# Altium project 采样模块1.PrjPcb
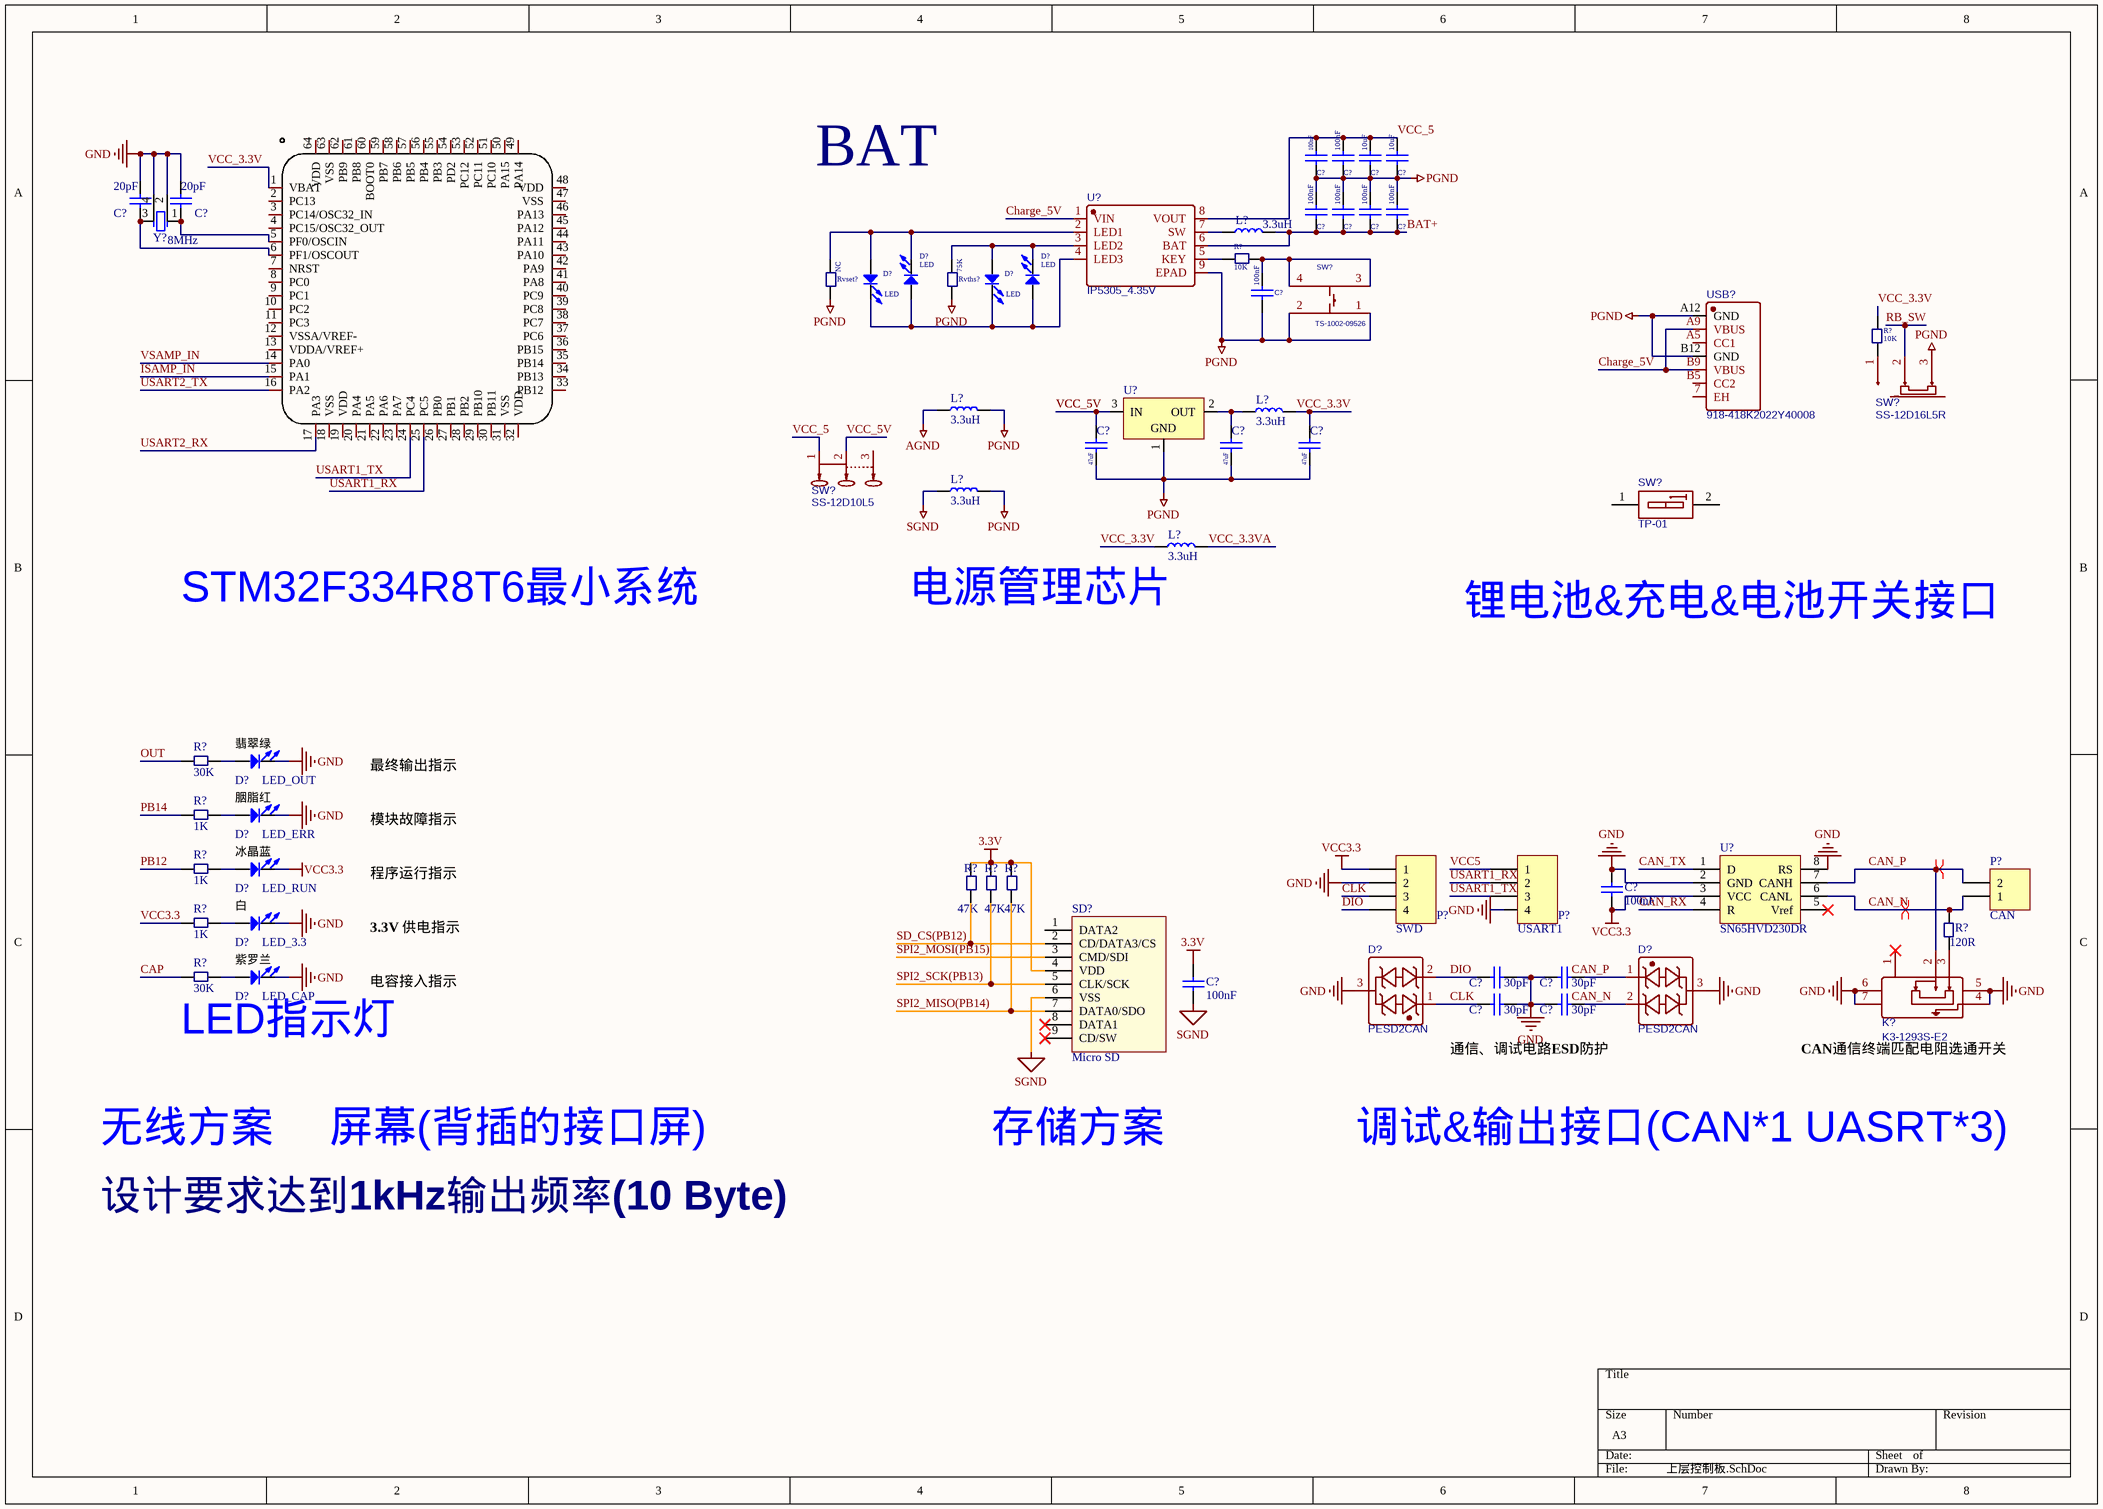
[diagram p0: 上层控制板.SchDoc]
3 sheets, 99 parts. Net scope: global (net labels, ports and power ports of the same name join across sheets).
Sheets:
  上层控制板.SchDoc
  下层功率板(铝基).SchDoc
  采样方案.SchDoc

## Sheet 上层控制板.SchDoc
size A3; SheetNumber: 1; SheetTotal: 3

### Parts
(Parts that share a designator on the sheet are numbered #1, #2 ... from top to bottom, then left to right.)
C?#1  100nF  [C_0603]
C?#2  100nF  [C_0603]
C?#3  10uF  [C_0603]
C?#4  10uF  [C_0603]
C?#5  20pF  [C_0603]
C?#6  20pF  [C_0603]
C?#7  100nF  [C_0603]
C?#8  100nF  [C_0603]
C?#9  100nF  [C_0603]
C?#10  100nF  [C_0603]
C?#11  100nF  [C_0603]
C?#12  47uF  [C_0603]
C?#13  47uF  [C_0603]
C?#14  47uF  [C_0603]
C?#15  100nF  [C_0603]
C?#16  30pF  [C_0603]
C?#17  100nF  [C_0402]
C?#18  30pF  [C_0603]
C?#19  30pF  [C_0603]
C?#20  30pF  [C_0603]
D?#1  LED  [D_SOD_323]
D?#2  LED  [D_SOD_323]
D?#3  LED  [D_SOD_323]
D?#4  LED  [D_SOD_323]
D?#5  LED_OUT  [D_SOD_323]
D?#6  LED_ERR  [D_SOD_323]
D?#7  LED_RUN  [D_SOD_323]
D?#8  LED_3.3  [D_SOD_323]
D?#9  LED_CAP  [D_SOD_323]
D?#10  PESD2CAN  [SOT-23-3_L2.9-W1.3-P1.90-LS2.4-BR]
D?#11  PESD2CAN  [SOT-23-3_L2.9-W1.3-P1.90-LS2.4-BR]
K?  K3-1293S-E2  [SW-TH_MSK12C02]
L?#1  3.3uH  [IND-SMD_L7.1-W6.6]
L?#2  3.3uH  [L_0805]
L?#3  3.3uH  [L_0805]
L?#4  3.3uH  [L_0805]
L?#5  3.3uH  [L_0805]
P?#1  SWD  [BM04B-GHS-TBT]
P?#2  USART1  [BM04B-GHS-TBT]
P?#3  CAN  [BM02B-GHS-TBT]
R?#1  10K  [R_0603]
R?#2  10K  [R_0603]
R?#3  30K  [R_0603]
R?#4  1K  [R_0603]
R?#5  1K  [R_0603]
R?#6  47K  [R_0402]
R?#7  47K  [R_0402]
R?#8  47K  [R_0402]
R?#9  1K  [R_0603]
R?#10  120R  [R_0603]
R?#11  30K  [R_0603]
Rvset?  NC  [R_0603]
Rvths?  75K  [R_0603]
SD?  Micro SD  [MICRO SD]
SW?#1  TS-1002-09526  [SW-TH_4P-L6.0-W6.0-P4.50-LS6.5]
SW?#2  SS-12D16L5R  [SW-TH_SS-12D16L5R]
SW?#3  SS-12D10L5  [SW-TH_SS-12D10L5]
SW?#4  TP-01  [SW-SMD_2P-L2.8-W5.4-P1.27-LS8.5]
U?#1  IP5305_4.35V  [SOP-8_L4.9-W3.9-P1.27-LS6.0-BL-EP]
U?#2  STM32F334R8T6  [LQFP-64_L10.0-W10.0-P0.50-LS12.0-BL]  (value not drawn)
U?#3  LM1117-3.3  [SOT_223]  (value not drawn)
U?#4  SN65HVD230DR  [SOIC127P600X175-8N]
USB?  918-418K2022Y40008  [USB-C-SMD_918-418K2022Y40008]
Y?  8MHz  [XTAL_3225]

### Nets
3.3V: C?#17.2 R?#6.2 R?#7.2 R?#8.2 SD?.4(VDD)
AGND: L?#2.1
CAP: R?#11.2
GND: C?#5.1 C?#6.1 C?#15.2 C?#16.2 C?#18.2 C?#19.2 C?#20.2 D?#5.2(K) D?#6.2(K) D?#8.2(K) D?#9.2(K) D?#10.3 D?#11.3 K?.4 K?.5 K?.6 K?.7 P?#1.2 P?#2.4 U?#4.2(GND) U?#4.8(RS) Y?.2 Y?.4
PGND: C?#1.1 C?#2.1 C?#3.1 C?#4.1 C?#7.2 C?#8.2 C?#9.2 C?#10.2 C?#11.1 C?#12.1 C?#13.1 C?#14.1 L?#2.2 L?#4.2 Rvset?.1 Rvths?.1 SW?#1.1 SW?#1.2 SW?#2.3 U?#1.9(EPAD) U?#3.1(GND) USB?.A12(GND) USB?.B12(GND)
SGND: C?#17.1 L?#4.1 SD?.6(VSS)
VCC3.3: C?#15.1 D?#7.2(K) P?#1.1 R?#9.2 U?#4.3(VCC)
BAT+: C?#7.1 C?#8.1 C?#9.1 C?#10.1 L?#1.2 U?#1.6(BAT)
CAN_N: P?#3.2(1) R?#10.1 U?#4.6(CANL)
CAN_P: K?.2 P?#3.1(2) U?#4.7(CANH)
CAN_RX: U?#4.4(R)
CAN_TX: U?#4.1(D)
Charge_5V: U?#1.1(VIN) USB?.A9(VBUS) USB?.B9(VBUS)
CLK: C?#18.1 D?#10.1 P?#1.3
DIO: C?#16.1 D?#10.2 P?#1.4
ISAMP_IN: U?#2.15(PA1)
OUT: R?#3.2
PB12: R?#5.2
PB14: R?#4.2
RB_SW: SW?#2.2
SD_CS(PB12): R?#6.1 SD?.2(CD/DATA3/CS)
SPI2_MISO(PB14): R?#8.1 SD?.7(DATA0/SDO)
SPI2_MOSI(PB15): SD?.3(CMD/SDI)
SPI2_SCK(PB13): R?#7.1 SD?.5(CLK/SCK)
USART1_RX: P?#2.2 U?#2.25(PC5)
USART1_TX: P?#2.3 U?#2.24(PC4)
USART2_RX: U?#2.17(PA3)
USART2_TX: U?#2.16(PA2)
VCC5: P?#2.1
VCC_3.3V: C?#14.2 L?#3.2 L?#5.1 R?#2.1 U?#2.1(VBAT)
VCC_3.3VA: L?#5.2
VCC_5: C?#1.2 C?#2.2 C?#3.2 C?#4.2 SW?#3.1 U?#1.8(VOUT)
VCC_5V: C?#12.2 SW?#3.2 U?#3.3(IN)
VSAMP_IN: U?#2.14(PA0)
NetC?#5_2: C?#5.2 U?#2.6(PF1/OSCOUT) Y?.3(OSC2)
NetC?#6_2: C?#6.2 U?#2.5(PF0/OSCIN) Y?.1(OSC1)
NetC?#11_2: C?#11.2 R?#1.1 SW?#1.3 SW?#1.4
NetC?#13_2: C?#13.2 L?#3.1 U?#3.2(OUT)
NetC?#19_1: C?#19.1 D?#11.1
NetC?#20_1: C?#20.1 D?#11.2
NetD?#1_1: D?#1.1(A) D?#3.2(K) Rvset?.2 U?#1.2(LED1)
NetD?#1_2: D?#1.2(K) D?#2.2(K) D?#3.1(A) D?#4.1(A) U?#1.4(LED3)
NetD?#2_1: D?#2.1(A) D?#4.2(K) Rvths?.2 U?#1.3(LED2)
NetD?#5_1: D?#5.1(A) R?#3.1
NetD?#6_1: D?#6.1(A) R?#4.1
NetD?#7_1: D?#7.1(A) R?#5.1
NetD?#8_1: D?#8.1(A) R?#9.1
NetD?#9_1: D?#9.1(A) R?#11.1
NetK?_3: K?.3 R?#10.2
NetL?#1_1: L?#1.1 U?#1.7(SW)
NetR?#1_2: R?#1.2 U?#1.5(KEY)
NetR?#2_2: R?#2.2 SW?#2.1

Not connected (* = marked no-connect by the designer): K? 1*; SD? 1(DATA2) 8(DATA1)* 9(CD/SW)*; SW?#3 3; SW?#4 1(A1) 2(A2); U?#2 2(PC13) 3(PC14/OSC32_IN) 4(PC15/OSC32_OUT) 7(NRST) 8(PC0) 9(PC1) 10(PC2) 11(PC3) 12(VSSA/VREF-) 13(VDDA/VREF+) 18(VSS) 19(VDD) 20(PA4) 21(PA5) 22(PA6) 23(PA7) 26(PB0) 27(PB1) 28(PB2) 29(PB10) 30(PB11) 31(VSS) 32(VDD) 33(PB12) 34(PB13) 35(PB14) 36(PB15) 37(PC6) 38(PC7) 39(PC8) 40(PC9) 41(PA8) 42(PA9) 43(PA10) 44(PA11) 45(PA12) 46(PA13) 47(VSS) 48(VDD) 49(PA14) 50(PA15) 51(PC10) 52(PC11) 53(PC12) 54(PD2) 55(PB3) 56(PB4) 57(PB5) 58(PB6) 59(PB7) 60(BOOT0) 61(PB8) 62(PB9) 63(VSS) 64(VDD); U?#4 5(Vref)*; USB? 7(EH) A5(CC1) B5(CC2)

### Layout directives
differential pair: CAN_P
differential pair; rule Undefined: CAN_N

### Notes on the sheet
- BAT
- STM32F334R8T6最小系统
- 电源管理芯片
- 锂电池&充电&电池开关接口
- (near D?#5) 翡翠绿
- 最终输出指示
- (near D?#6) 胭脂红
- (near D?#7) 冰晶蓝
- 模块故障指示
- (near D?#8) 白
- 程序运行指示
- (near D?#9) 紫罗兰
- 3.3V 供电指示
- 电容接入指示
- LED指示灯
- (near C?#18) 通信、调试电路ESD防护
- (near K?) CAN通信终端匹配电阻选通开关
- 无线方案
- 屏幕(背插的接口屏)
- 存储方案
- 调试&输出接口(CAN*1 UASRT*3)
- 设计要求达到1kHz输出频率(10 Byte)
- Labels drawn without touching a wire or pin: CAN_N, CAN_P

### Library data of the parts
C?#1-C?#20 = Cap: Capacitor; Published: 8-Jun-2000; LatestRevisionDate: 17-Jul-2002; LatestRevisionNote: Re-released for DXP Platform.; PackageReference: RAD-0.3; Publisher: Altium Limited; PackageDescription: Radial Cap, Thru-Hole; 2 Leads; 0.3 in Pin Spacing
D?#1-D?#9 = LED: Typical INFRARED GaAs LED; Published: 8-Jun-2000; LatestRevisionDate: 08-Jul-2005; LatestRevisionNote: Mech Layer 1 removed.; PackageReference: LED-0; Publisher: Altium Limited; PackageDescription: LED; 2 Leads
D?#10 D?#11 = PESD2CAN_C907830: BOM_Manufacturer: TECH PUBLIC; Contributor: LCSC; BOM_Supplier: LCSC; BOM_Supplier Part: C907830; BOM_Manufacturer Part: PESD2CAN; BOM_JLCPCB Part Class: Extended Part; spicePre: D; spiceSymbolName: PESD2CAN_C907830
K? = MSK12C02: BOM_Manufacturer: SHOU HAN; Contributor: LCSC; BOM_Supplier: LCSC; BOM_Supplier Part: C431540; BOM_Manufacturer Part: MSK12C02; BOM_JLCPCB Part Class: Extended Part; spicePre: S; spiceSymbolName: MSK12C02
L?#1-L?#5 = Inductor: Code_IEC: 1005; Published: 8-Jun-2000; LatestRevisionDate: 17-Jul-2002; LatestRevisionNote: Re-released for DXP Platform.; PackageReference: 0402-A; Publisher: Altium Limited; Code_JEITA: 0402
P?#1 P?#2 = Header 4: SM04B-GHS-TB; LatestRevisionDate: 17-Jul-2002; LatestRevisionNote: Re-released for DXP Platform.; Publisher: Altium Limited
P?#3 = Header 2: SM02B-GHS-TB; LatestRevisionDate: 17-Jul-2002; LatestRevisionNote: Re-released for DXP Platform.; Publisher: Altium Limited
R?#1 R?#2 R?#6-R?#8 Rvset? Rvths? = Res2: Resistor; Published: 8-Jun-2000; LatestRevisionDate: 17-Jul-2002; LatestRevisionNote: Re-released for DXP Platform.; PackageReference: AXIAL-0.4; Publisher: Altium Limited
R?#3-R?#5 R?#9-R?#11 = Res: Resistor; Published: 8-Jun-2000; LatestRevisionDate: 17-Jul-2002; LatestRevisionNote: Re-released for DXP Platform.; PackageReference: AXIAL-0.4; Publisher: Altium Limited
SD? = Micro SD: Micro SD卡; 版权归属: 源创客; BOM名称: Micro SD卡; 学习资源: www.ooocke.com
SW?#1 = TS-1002-09526: BOM_Manufacturer: XUNPU; Contributor: LCSC; BOM_Supplier: LCSC; BOM_Supplier Part: C455100; BOM_Manufacturer Part: TS-1002-09526; BOM_JLCPCB Part Class: Extended Part; spicePre: S; spiceSymbolName: TS-1002-09526
SW?#2 = SS-12D16L5R: BOM_Manufacturer: XKB Enterprise; Contributor: LCSC; BOM_Supplier: LCSC; BOM_Supplier Part: C388634; BOM_Manufacturer Part: SS-12D16L5R; BOM_JLCPCB Part Class: Extended Part; spicePre: S; spiceSymbolName: SS-12D16L5R
SW?#3 = SS-12D10L5: BOM_Manufacturer: XKB Enterprise; Contributor: LCSC; BOM_Supplier: LCSC; BOM_Supplier Part: C319012; BOM_Manufacturer Part: SS-12D10L5; BOM_JLCPCB Part Class: Extended Part; spicePre: S; spiceSymbolName: SS-12D10L5
SW?#4 = SW_TP-01: BOM_Manufacturer: Yuandi; Contributor: LCSC; BOM_Supplier: LCSC; BOM_Supplier Part: C559164; BOM_Manufacturer Part: TP-01; BOM_JLCPCB Part Class: Extended Part; spicePre: S; spiceSymbolName: TP-01
U?#1 = IP5305_4.35V: BOM_Manufacturer: INJOINIC; Contributor: LCSC; BOM_Supplier: LCSC; BOM_Supplier Part: C180942; BOM_Manufacturer Part: IP5305_4.35V; BOM_JLCPCB Part Class: Extended Part; spicePre: U; spiceSymbolName: IP5305_4.35V
U?#2 = U STM32F334R8T6: Manufacturer: ST(意法半导体); Add into BOM: yes; CPU Core: ARM Cortex-M4; Maximum Frequency: 72MHz; Supply Voltage Range: 2V~3.6V; Internal Oscillator: 有; Program FLASH Size: 64K@x8bit; RAM Size: 12KB; GPIO Ports Number: 51; ADC (Units/Channels/bits): 1@x21ch/12bit; DAC (Units/Channels/bits): 1@x3ch/12bit; Peripherals / Functions / Protocol Stacks: DMA；看门狗；POR；PWM; Name: STM32F334R8T6; Symbol: STM32F334R8T6; Device: STM32F334R8T6; LCSC Part Name: ARM Cortex-M4 72MHz 闪存：64K@x8bit RAM：12KB; Supplier Part: C80577; Manufacturer Part: STM32F334R8T6; Supplier Footprint: LQFP-64(10x10); JLCPCB Part Class: Extended Part; Datasheet: https://atta.szlcsc.com/upload/public/pdf/source/20170712/C80577_1499832474154814708.pdf; Supplier: LCSC; Convert to PCB: yes; EEPROM/Data FLASH Size: -; Operating Temperature Range: -40℃~+85℃
U?#3 = LM1117-3.3: 800mA Low-Dropout Linear Regulator, 3-pin TO-220; PartNumber: LM1117T-3.3; Manufacturer: National Semiconductor; PackageTopMarking: NSUZXYTTE#*LM1117T*3.3; PowerWise: N; CompType: LDO IC; Published: 4-Dec-2008; DatasheetVersion: Apr-2006; PackageVersion: revL, Jan-1992; PackageReference: T03B; Publisher: Altium Limited; PackageDescription: TO-220, Molded, 3 Lead, Straight; Supplier 1: Farnell; Supplier Part Number 1: 9485813; RoHS: N; PinCount: 3; ComponentLink1Description: LM1117 Datasheet; ComponentLink1URL: http://www.national.com/ds/LM/LM1117.pdf; ComponentLink2Description: LM1117 Web Page; ComponentLink2URL: http://www.national.com/pf/LM/LM1117.html; ComponentLink3Description: T03B Package Page; ComponentLink3URL: http://www.national.com/packaging/folders/t03b.html
U?#4 = SN65HVD230
USB? = TYPEC1: BOM_Manufacturer: 精拓金; Contributor: LCSC; BOM_Supplier: LCSC; BOM_Supplier Part: C399937; BOM_Manufacturer Part: 918-418K2022Y40008; BOM_JLCPCB Part Class: Extended Part; spicePre: U; spiceSymbolName: 918-418K2022Y40008
Y? = XTAL_4: 8MHz/3225无源; Published: 8-Jun-2000; LatestRevisionDate: 17-Jul-2002; LatestRevisionNote: Re-released for DXP Platform.; PackageReference: R38; Publisher: Altium Limited

## Sheet 下层功率板(铝基).SchDoc
size A4; SheetNumber: 2; SheetTotal: 3
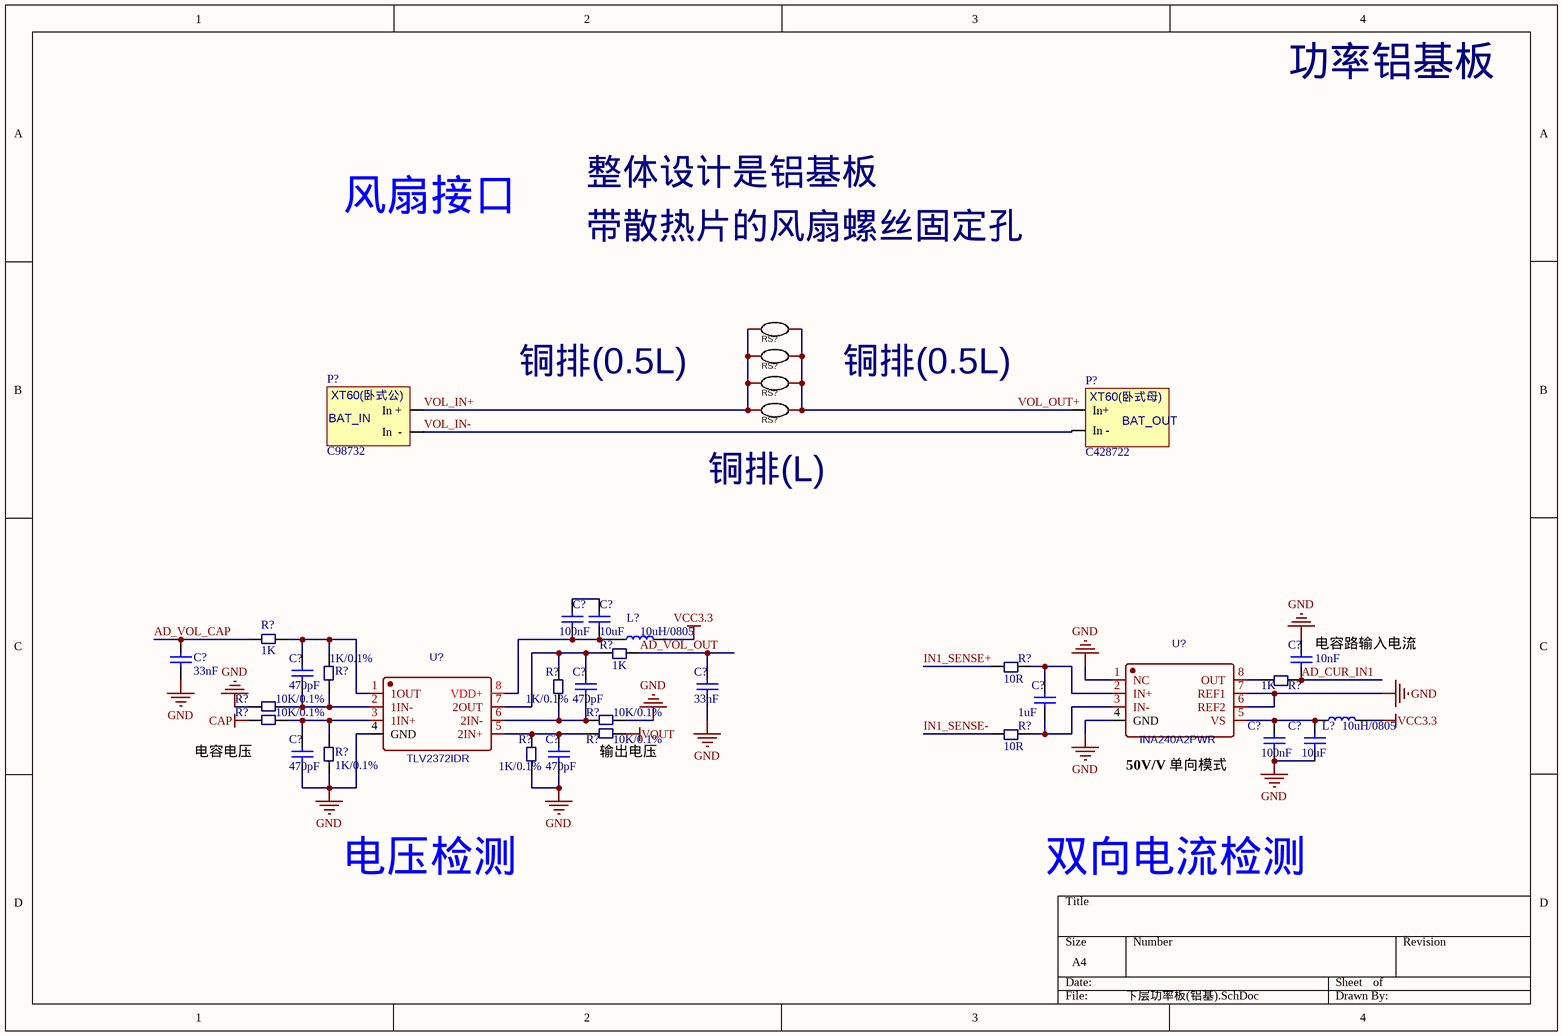
[diagram p1: 下层功率板(铝基).SchDoc]

### Parts
(Parts that share a designator on the sheet are numbered #1, #2 ... from top to bottom, then left to right.)
C?#21  100nF  [C_0603]
C?#22  10uF  [C_0603]
C?#23  33nF  [C_0603]
C?#24  10nF  [C_0603]
C?#25  470pF  [C_0603]
C?#26  470pF  [C_0603]
C?#27  33nF  [C_0603]
C?#28  1uF  [C_0603]
C?#29  100nF  [C_0603]
C?#30  10uF  [C_0603]
C?#31  470pF  [C_0603]
C?#32  470pF  [C_0603]
L?#6  10uH/0805  [L_0805]
L?#7  10uH/0805  [L_0805]
P?#4  C428722  [TX60PW-F20]
P?#5  C98732  [TX60PW-M20]
R?#12  1K  [R_0603]
R?#13  1K  [R_0603]
R?#14  1K/0.1%  [R_0603]
R?#15  10R  [R_0603]
R?#16  1K/0.1%  [R_0603]
R?#17  1K  [R_0603]
R?#18  10K/0.1%  [R_0603]
R?#19  10K/0.1%  [R_0603]
R?#20  10K/0.1%  [R_0603]
R?#21  10K/0.1%  [R_0603]
R?#22  10R  [R_0603]
R?#23  1K/0.1%  [R_0603]
R?#24  1K/0.1%  [R_0603]
RS?#1  HolRS3920-5W-0.3mR-1%  [R3920]  (value not drawn)
RS?#2  HolRS3920-5W-0.3mR-1%  [R3920]  (value not drawn)
RS?#3  HolRS3920-5W-0.3mR-1%  [R3920]  (value not drawn)
RS?#4  HolRS3920-5W-0.3mR-1%  [R3920]  (value not drawn)
U?#5  INA240A2PWR  [TSSOP-8_L4.4-W3.0-P0.65-LS6.4-BL]
U?#6  TLV2372IDR  [SOIC_8]

### Nets
CAP: R?#19.2
GND: C?#23.1 C?#24.2 C?#27.1 C?#29.1 C?#30.1 C?#31.1 C?#32.1 R?#18.2 R?#20.1 R?#23.2 R?#24.2 U?#5.1(NC) U?#5.4(GND) U?#5.6(REF2) U?#5.7(REF1) U?#6.4(GND)
VCC3.3: L?#6.2 L?#7.2
VOUT: R?#21.1
AD_CUR_IN1: C?#24.1 R?#17.2
AD_VOL_CAP: C?#23.2 R?#12.2
AD_VOL_OUT: C?#27.2 R?#13.2
IN1_SENSE+: R?#15.1
IN1_SENSE-: R?#22.1
VOL_IN+: P?#5.1(In_+) RS?#1.1 RS?#2.1 RS?#3.1 RS?#4.1
VOL_IN-: P?#4.2(In_-) P?#5.2(In__-)
VOL_OUT+: P?#4.1(In+) RS?#1.2 RS?#2.2 RS?#3.2 RS?#4.2
NetC?#21_1: C?#21.1 C?#22.1
NetC?#21_2: C?#21.2 C?#22.2 L?#6.1 U?#6.8(VDD+)
NetC?#25_1: C?#25.1 R?#14.2 R?#18.1 U?#6.2(1IN-)
NetC?#25_2: C?#25.2 R?#12.1 R?#14.1 U?#6.1(1OUT)
NetC?#26_1: C?#26.1 R?#16.2 R?#20.2 U?#6.6(2IN-)
NetC?#26_2: C?#26.2 R?#13.1 R?#16.1 U?#6.7(2OUT)
NetC?#28_1: C?#28.1 R?#22.2 U?#5.3(IN-)
NetC?#28_2: C?#28.2 R?#15.2 U?#5.2(IN+)
NetC?#29_2: C?#29.2 C?#30.2 L?#7.1 U?#5.5(VS)
NetC?#31_2: C?#31.2 R?#19.1 R?#23.1 U?#6.3(1IN+)
NetC?#32_2: C?#32.2 R?#21.2 R?#24.1 U?#6.5(2IN+)
NetR?#17_1: R?#17.1 U?#5.8(OUT)

### Notes on the sheet
- 功率铝基板
- 风扇接口
- 带散热片的风扇螺丝固定孔
- 整体设计是铝基板
- 铜排(0.5L)
- (near RS?#4) 铜排(L)
- (near C?#24) 电容路输入电流
- (near R?#19) 电容电压
- (near R?#21) 输出电压
- (near U?#5) 50V/V 单向模式
- 电压检测
- 双向电流检测
- (in symbol P_PW_XT60_FM_卧式) XT60(卧式母); BAT_OUT
- (in symbol P_PW_XT60_M_卧式) XT60(卧式公); BAT_IN

### Library data of the parts
C?#21-C?#32 = Cap: Capacitor; Published: 8-Jun-2000; LatestRevisionDate: 17-Jul-2002; LatestRevisionNote: Re-released for DXP Platform.; PackageReference: RAD-0.3; Publisher: Altium Limited; PackageDescription: Radial Cap, Thru-Hole; 2 Leads; 0.3 in Pin Spacing
L?#6 L?#7 = Inductor: Code_IEC: 1005; Published: 8-Jun-2000; LatestRevisionDate: 17-Jul-2002; LatestRevisionNote: Re-released for DXP Platform.; PackageReference: 0402-A; Publisher: Altium Limited; Code_JEITA: 0402
P?#4 = P_PW_XT60_FM_卧式: XT60_PW_M / XT60母头输入
P?#5 = P_PW_XT60_M_卧式: XT60_PW_M / XT60公头输入
R?#12-R?#24 = Res: Resistor; Published: 8-Jun-2000; LatestRevisionDate: 17-Jul-2002; LatestRevisionNote: Re-released for DXP Platform.; PackageReference: AXIAL-0.4; Publisher: Altium Limited
RS?#1-RS?#4 = C558626: Manufacturer: Milliohm(毫欧); Name: 0.3mΩ; Add into BOM: yes; Value: 0.3mΩ; Tolerance: ±1%; Power(Watts): 5W; Symbol: HOLRS3920-5W-0.3MR-1%; Device: HolRS3920-5W-0.3mR-1%; LCSC Part Name: 0.3mΩ ±1% 5W; Supplier Part: C558626; Manufacturer Part: HolRS3920-5W-0.3mR-1%; Supplier Footprint: 3920; JLCPCB Part Class: Extended Part; Datasheet: https://atta.szlcsc.com/upload/public/pdf/source/20200522/C558625_7915B34B9186274EB7EA9862EBA9CEA8.pdf; Supplier: LCSC; Convert to PCB: yes
U?#5 = INA240A1PWR: BOM_Manufacturer: TI; Contributor: LCSC; SMT Type: Extend; BOM_Supplier: LCSC; BOM_Manufacturer Part: INA240A1PWR; BOM_Supplier Part: C93965; BOM_LCSC Assembly: Yes; spicePre: U; spiceSymbolName: INA240A1PWR
U?#6 = TLV2372IDR: BOM_Manufacturer: TI; SMT Type: Extend; BOM_Supplier: LCSC; BOM_Manufacturer Part: TLV2372IDR; BOM_Supplier Part: C27204; BOM_LCSC Assembly: Yes; spicePre: U; spiceSymbolName: TLV2372IDR

## Sheet 采样方案.SchDoc
size A4; SheetNumber: 3; SheetTotal: 3
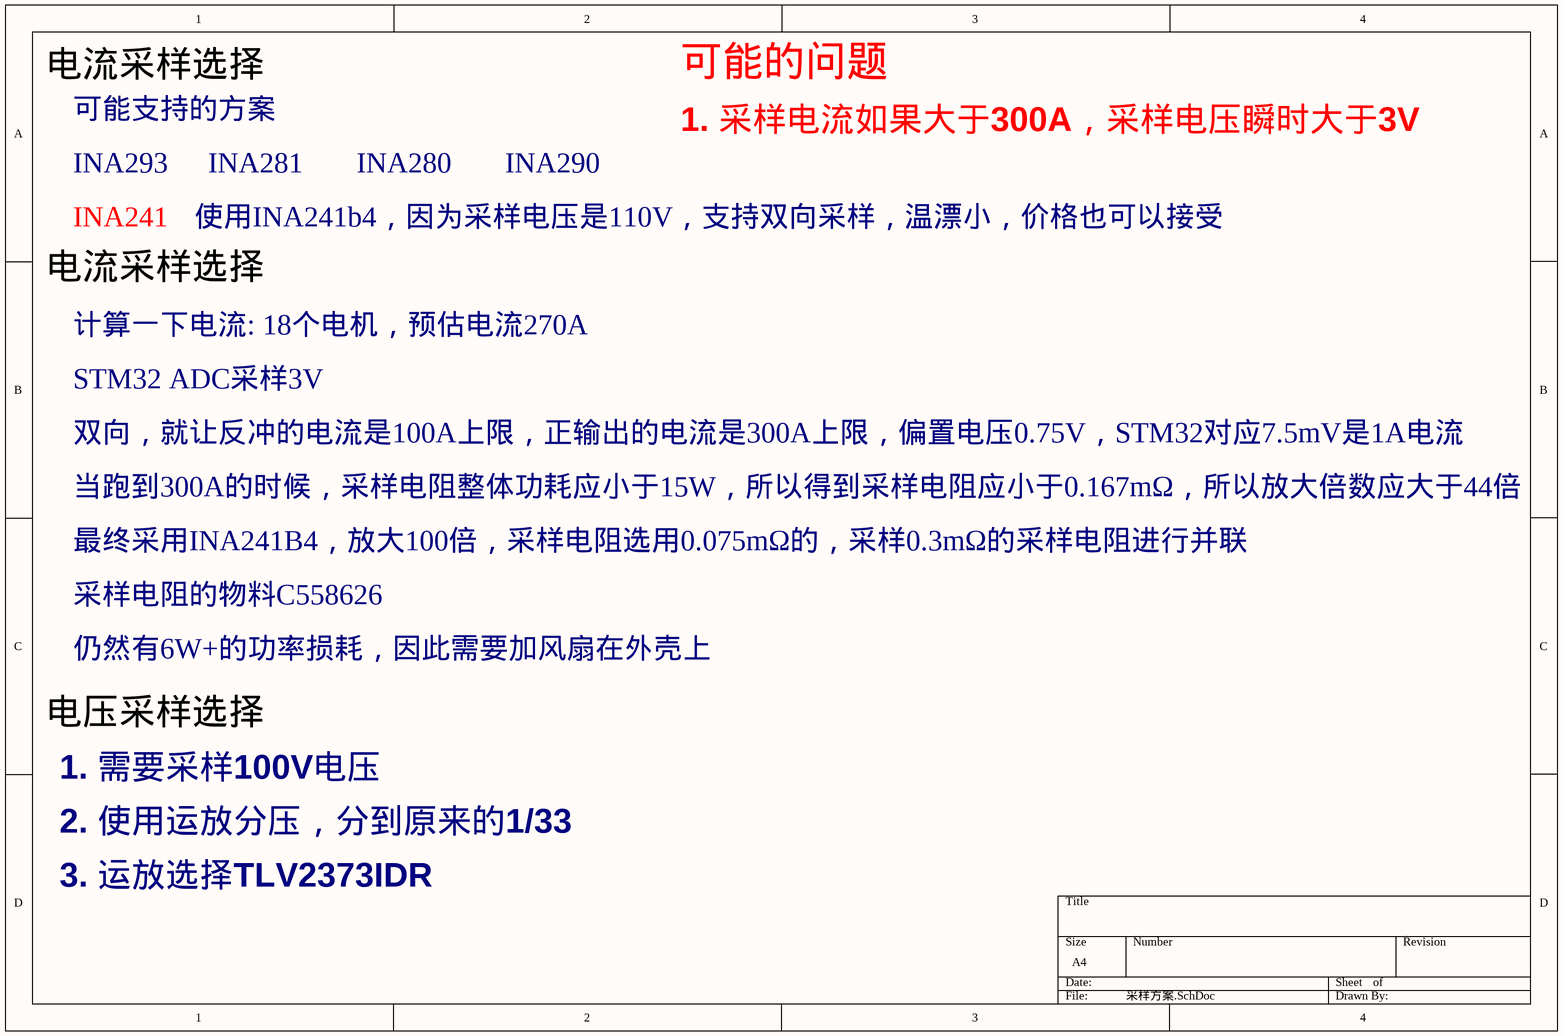
[diagram p2: 采样方案.SchDoc]

### Notes on the sheet
- 电流采样选择
- 可能的问题
- 可能支持的方案
- INA293
- INA281
- INA280
- INA290
- 1. 采样电流如果大于300A，采样电压瞬时大于3V
- INA241
- 使用INA241b4，因为采样电压是110V，支持双向采样，温漂小，价格也可以接受
- 计算一下电流: 18个电机，预估电流270A
- STM32 ADC采样3V
- 双向，就让反冲的电流是100A上限，正输出的电流是300A上限，偏置电压0.75V，STM32对应7.5mV是1A电流
- 当跑到300A的时候，采样电阻整体功耗应小于15W，所以得到采样电阻应小于0.167mΩ，所以放大倍数应大于44倍
- 最终采用INA241B4，放大100倍，采样电阻选用0.075mΩ的，采样0.3mΩ的采样电阻进行并联
- 采样电阻的物料C558626
- 仍然有6W+的功率损耗，因此需要加风扇在外壳上
- 电压采样选择
- 1. 需要采样100V电压
- 2. 使用运放分压，分到原来的1/33
- 3. 运放选择TLV2373IDR

## Nets that join several sheets
CAP: 上层控制板 (R?#11.2), 下层功率板(铝基) (R?#19.2)
GND: 上层控制板 (23 pins), 下层功率板(铝基) (16 pins)
VCC3.3: 上层控制板 (5 pins), 下层功率板(铝基) (L?#6.2 L?#7.2)